# Altium schematic sheet gsm.SchDoc
size B
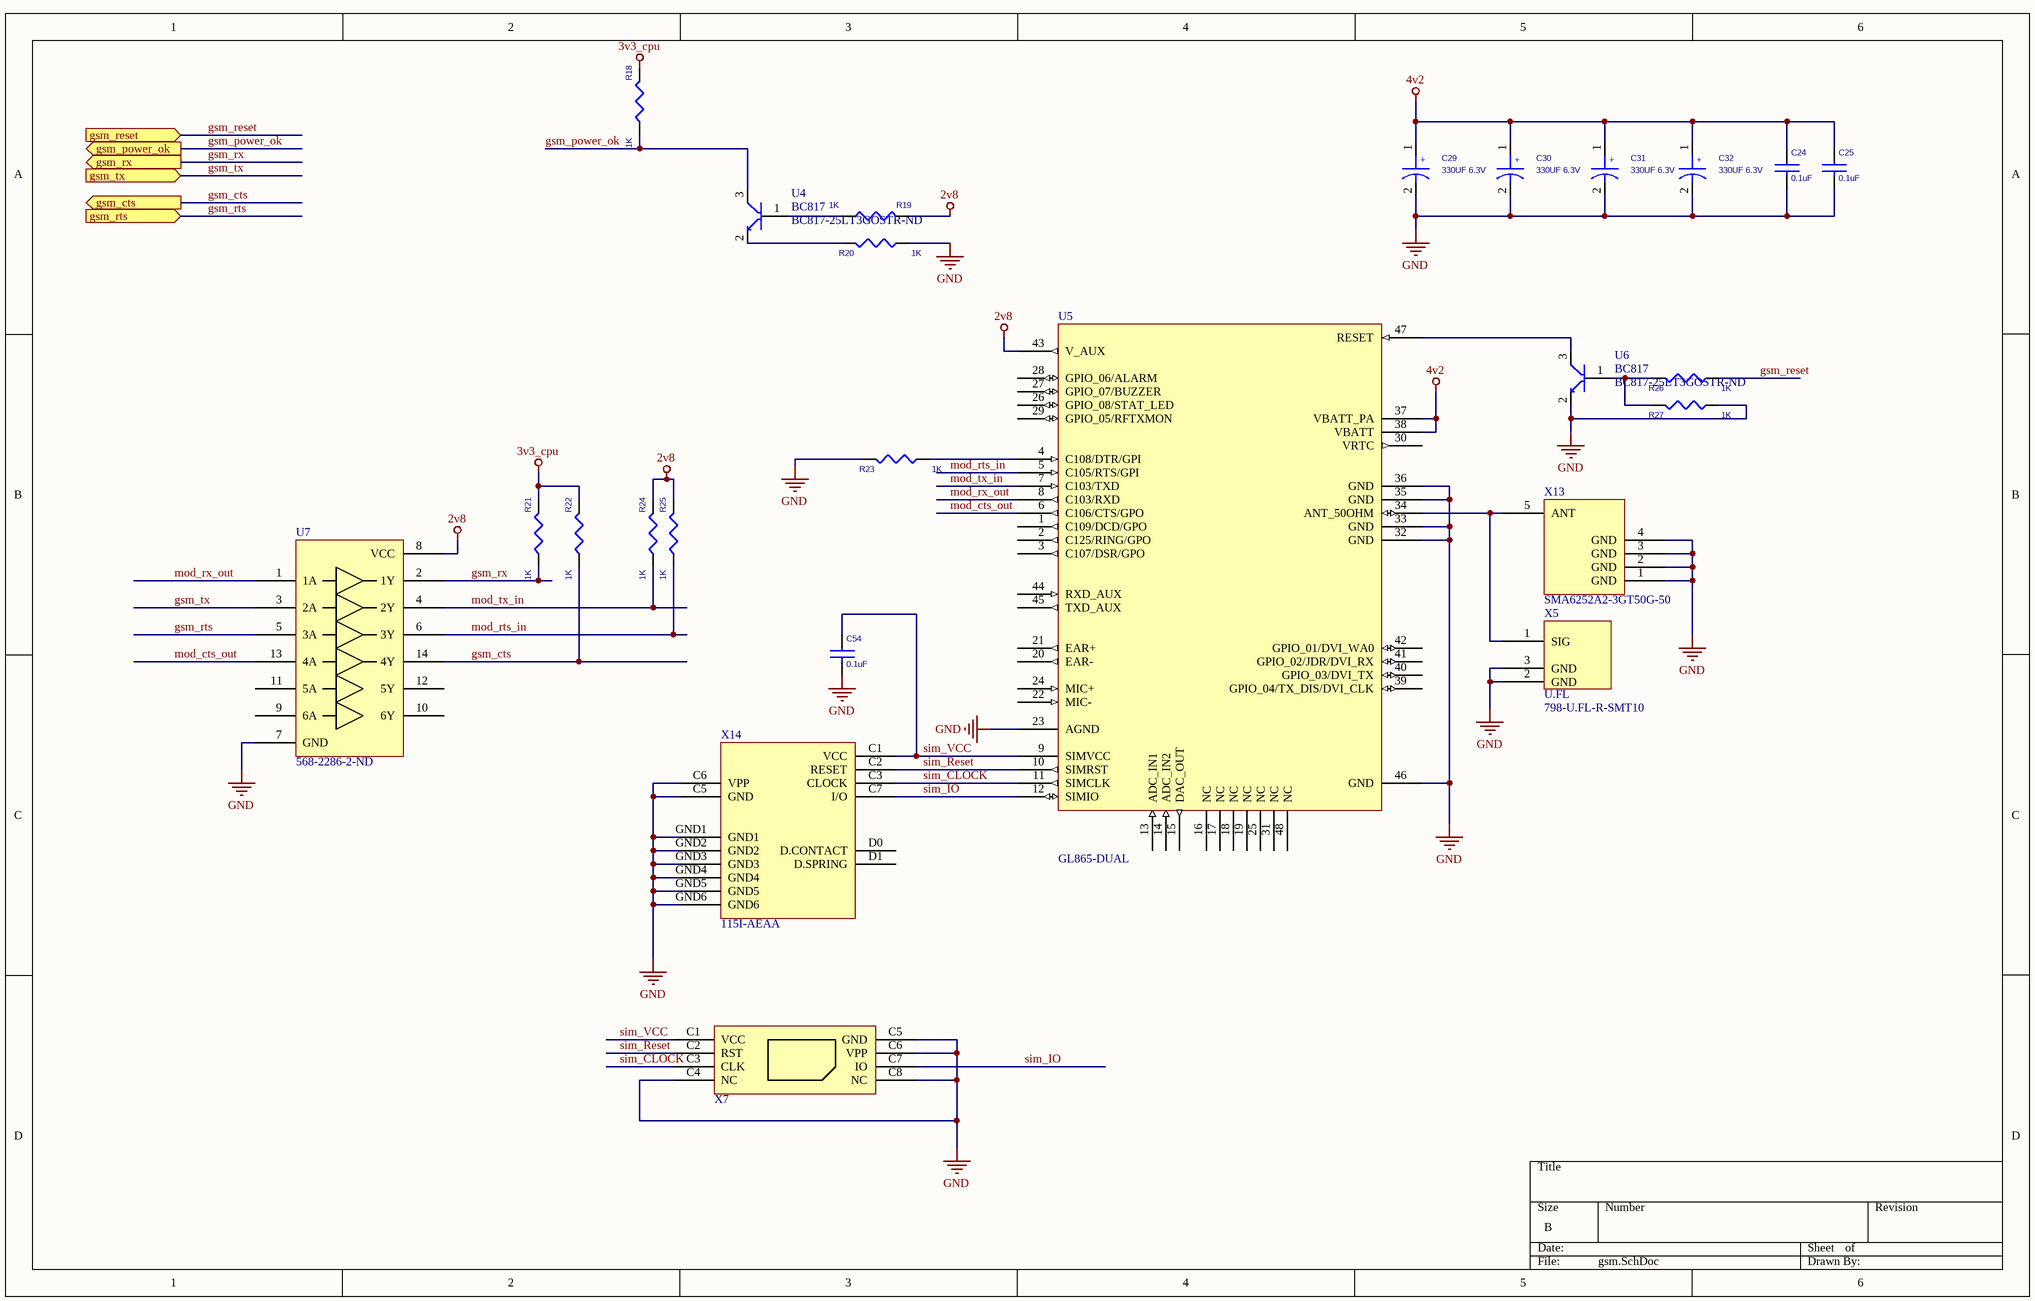
[diagram p0: gsm.SchDoc]

## Parts
C24  0.1uF  [CAPC2012X09M]
C25  0.1uF  [CAPC2012X09M]
C29  330UF 6.3V  [CAPMP7143X31N]
C30  330UF 6.3V  [CAPMP7143X31N]
C31  330UF 6.3V  [CAPMP7143X31N]
C32  330UF 6.3V  [CAPMP7143X31N]
C54  0.1uF  [CAPC2012X09M]
R18  1K  [RESC2013X06M]
R19  1K  [RESC2013X06M]
R20  1K  [RESC2013X06M]
R21  1K  [RESC2013X06M]
R22  1K  [RESC2013X06M]
R23  1K  [RESC2013X06M]
R24  1K  [RESC2013X06M]
R25  1K  [RESC2013X06M]
R26  1K  [RESC2013X06M]
R27  1K  [RESC2013X06M]
U4  BC817  Supplier Part Number 1: BC817-25LT3GOSTR-ND  [SOT95P237X111-3N_SOT-23]
U5  GL865-DUAL  [GL865_FOOT]
U6  BC817  Supplier Part Number 1: BC817-25LT3GOSTR-ND  [SOT95P237X111-3N_SOT-23]
U7  Supplier Part Number 1: 568-2286-2-ND  [TSOP127P600X145-14N]  (hidden comment: 74LVC07A)
X5  U.FL  Supplier Part Number 1: 798-U.FL-R-SMT10  [U.FL]
X7  MOLEX  [MOLEX-91228-001]  (value not drawn)
X13  SMA6252A2-3GT50G-50  [SMA6252A2-3GT50G-50]
X14  115I-AEAA  [115I-AEAA]

## Ports
gsm_cts (out), gsm_power_ok (out), gsm_reset (in), gsm_rts (in), gsm_rx (out), gsm_tx (in)

## Nets
2v8: R19.2 R24.2 R25.2 U5.43(V_AUX) U7.8(VCC)
3v3_cpu: R18.2 R21.2 R22.2
4v2: C24.1 C25.1 C29.1 C30.1 C31.1 C32.1 U5.37(VBATT_PA) U5.38(VBATT)
GND: C24.2 C25.2 C29.2 C30.2 C31.2 C32.2 C54.2 R20.1 R23.2 R27.1 U5.23(AGND) U5.32(GND) U5.33(GND) U5.35(GND) U5.36(GND) U5.46(GND) U6.2(E) U7.7(GND) X5.2(GND) X5.3(GND) X7.C4(NC) X7.C5(GND) X7.C6(VPP) X7.C8(NC) X13.1(GND) X13.2(GND) X13.3(GND) X13.4(GND) X14.C5(GND) X14.C6(VPP) X14.GND1 X14.GND2 X14.GND3 X14.GND4 X14.GND5 X14.GND6
gsm_cts: R22.1 U7.14(4Y) ; port gsm_cts
gsm_power_ok: R18.1 U4.3(C) ; port gsm_power_ok
gsm_reset: R26.1 ; port gsm_reset
gsm_rts: U7.5(3A) ; port gsm_rts
gsm_rx: R21.1 U7.2(1Y) ; port gsm_rx
gsm_tx: U7.3(2A) ; port gsm_tx
mod_cts_out: U5.6(C106/CTS/GPO) U7.13(4A)
mod_rts_in: R25.1 U5.5(C105/RTS/GPI) U7.6(3Y)
mod_rx_out: U5.8(C103/RXD) U7.1(1A)
mod_tx_in: R24.1 U5.7(C103/TXD) U7.4(2Y)
sim_CLOCK: U5.11(SIMCLK) X7.C3(CLK) X14.C3(CLOCK)
sim_IO: U5.12(SIMIO) X7.C7(IO) X14.C7(I/O)
sim_Reset: U5.10(SIMRST) X7.C2(RST) X14.C2(RESET)
sim_VCC: C54.1 U5.9(SIMVCC) X7.C1(VCC) X14.C1(VCC)
NetR19_1: R19.1 U4.1(B)
NetR20_2: R20.2 U4.2(E)
NetR23_1: R23.1 U5.4(C108/DTR/GPI)
NetR26_2: R26.2 R27.2 U6.1(B)
NetU5_34: U5.34(ANT_50OHM) X5.1(SIG) X13.5(ANT)
NetU5_47: U5.47(RESET) U6.3(C)

Not connected (* = marked no-connect by the designer): U5 1(C109/DCD/GPO) 2(C125/RING/GPO) 3(C107/DSR/GPO) 13(ADC_IN1) 14(ADC_IN2) 15(DAC_OUT) 16(NC) 17(NC) 18(NC) 19(NC) 20(EAR-) 21(EAR+) 22(MIC-) 24(MIC+) 25(NC) 26(GPIO_08/STAT_LED) 27(GPIO_07/BUZZER) 28(GPIO_06/ALARM) 29(GPIO_05/RFTXMON) 30(VRTC) 31(NC) 39(GPIO_04/TX_DIS/DVI_CLK) 40(GPIO_03/DVI_TX) 41(GPIO_02/JDR/DVI_RX) 42(GPIO_01/DVI_WA0) 44(RXD_AUX) 45(TXD_AUX) 48(NC); U7 9(6A) 10(6Y) 11(5A) 12(5Y); X14 D0(D.CONTACT) D1(D.SPRING)

## Notes on the sheet
- (in symbol CAP_SMD_330UF_10%) +

## Library data of the parts
C24 C25 C54 = CAP_SMD_0.1UF_10%: CAP CER 0.1UF 25V 10% X7R 0805; Value: 0.1uF; Supplier 1: Digi-Key; Supplier Part Number 1: 399-1168-6-ND
C29-C32 = CAP_SMD_330UF_10%: CAP 330uF; 6.3V; Case: D; Supplier 1: Digi-Key; Supplier Part Number 1: 399-10398-1-ND
R18-R27 = RES_SMD_1K_5%: RES - 1K OHM, 5%, 1/8W, 0805 SMD; Supplier 1: Digi-Key; Supplier Part Number 1: P1.0KADKR-ND
X7 = MOLEX_SIM
X13 = SMA_CONN: Supplier 1: Mouser; Supplier Part Number 1: 523-901-143-6RFX
X14 = SIM_CARD_115I-AEAA: Supplier 1: TME; Supplier Part Number 1: 115I-AEAA
U4 U6 = BC817: Supplier 1: Digi-Key
U7 = 74LVC07A: Supplier 1: Digi-Key
X5 = U.FL: Supplier 1: Mouser